# Altium schematic sheet [04] - Display.SchDoc: =ProjectName
size A4; CheckedBy: Ven; Author: Ven; CompanyName: HUST; Revision: V.1.0
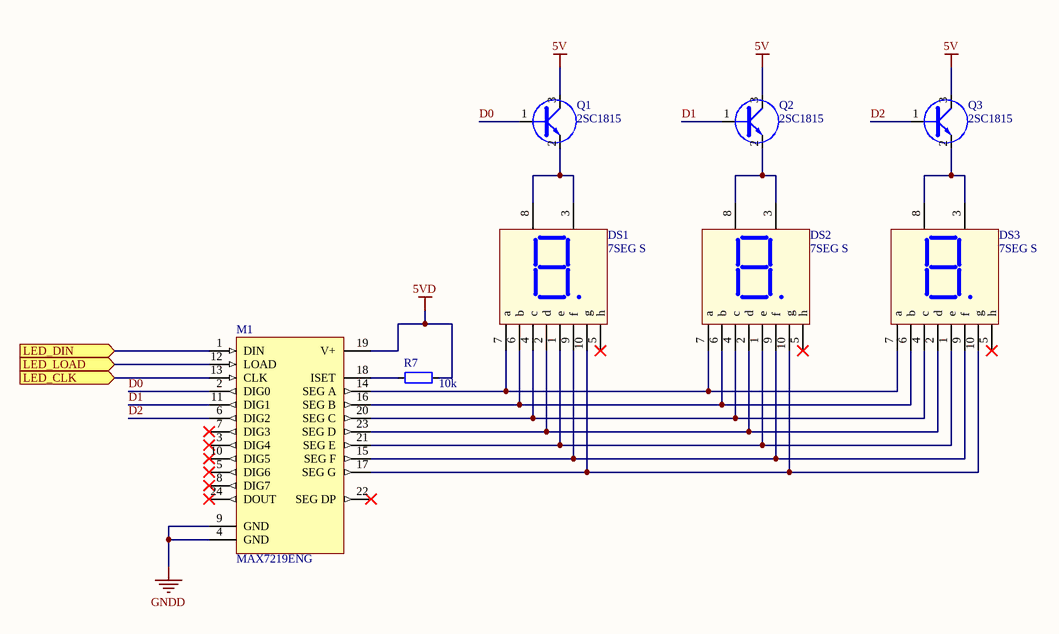
[diagram p0: [04] - Display.SchDoc]

## Parts
DS1  7SEG S  [7SEGS]
DS2  7SEG S  [7SEGS]
DS3  7SEG S  [7SEGS]
M1  MAX7219ENG  [DIP24/W0.3]
Q1  2SC1815  [SOT23D]
Q2  2SC1815  [SOT23D]
Q3  2SC1815  [SOT23D]
R7  10k  [RES-SMD-0805]

## Ports
LED_CLK (in), LED_DIN (in), LED_LOAD (in)

## Nets
5V: Q1.3(C) Q2.3(C) Q3.3(C)
5VD: M1.19(V+) R7.1
GNDD: M1.4(GND) M1.9(GND)
D0: M1.2(DIG0) Q1.1(B)
D1: M1.11(DIG1) Q2.1(B)
D2: M1.6(DIG2) Q3.1(B)
LED_CLK: M1.13(CLK) ; port LED_CLK
LED_DIN: M1.1(DIN) ; port LED_DIN
LED_LOAD: M1.12(LOAD) ; port LED_LOAD
NetDS1_1: DS1.1(e) DS2.1(e) DS3.1(e) M1.21(SEG_E)
NetDS1_2: DS1.2(d) DS2.2(d) DS3.2(d) M1.23(SEG_D)
NetDS1_3: DS1.3(Vcc) DS1.8(Vcc) Q1.2(E)
NetDS1_4: DS1.4(c) DS2.4(c) DS3.4(c) M1.20(SEG_C)
NetDS1_6: DS1.6(b) DS2.6(b) DS3.6(b) M1.16(SEG_B)
NetDS1_7: DS1.7(a) DS2.7(a) DS3.7(a) M1.14(SEG_A)
NetDS1_9: DS1.9(f) DS2.9(f) DS3.9(f) M1.15(SEG_F)
NetDS1_10: DS1.10(g) DS2.10(g) DS3.10(g) M1.17(SEG_G)
NetDS2_3: DS2.3(Vcc) DS2.8(Vcc) Q2.2(E)
NetDS3_3: DS3.3(Vcc) DS3.8(Vcc) Q3.2(E)
NetM1_18: M1.18(ISET) R7.2

Not connected (* = marked no-connect by the designer): DS1 5(h)*; DS2 5(h)*; DS3 5(h)*; M1 3(DIG4)* 5(DIG6)* 7(DIG3)* 8(DIG7)* 10(DIG5)* 22(SEG_DP)* 24(DOUT)*

## Notes on the sheet
- Project:
- Page Contents:
- Size:
- Date:
- A4
- Checked by:
- Time:
- Revision:
- Sheet
- of
- File:

## Library data of the parts
DS1-DS3 = LED7S: Single 7 Seg Dipslay; Value: LED 7S SEG
M1 = MAX7219ENG: Serially Interfaced, 8-Digit LED Display Driver; Published: 16-Jan-2001; LatestRevisionDate: 29-May-2009; LatestRevisionNote: Component Body Added.; DatasheetVersion: Jul-1997; PackageVersion: 1997; PackageReference: NG24A; Publisher: Altium Limited; PackageDescription: DIP, 24-Pin, Row Spacing 7.62 mm, Pitch 2.54 mm; Code_JEDEC: MS-001-AF; ComponentLink1Description: Manufacturer Link; ComponentLink1URL: http://www.maxim-ic.com/; ComponentLink2Description: Datasheet; ComponentLink2URL: http://pdfserv.maxim-ic.com/en/ds/MAX7219-MAX7221.pdf
Q1-Q3 = 2SC1815: NPN 600mW, ECB; Value: C1815
R7 = Resistor - SMD: Resistor; Manufacturer: Generic Components; Class: Passive; Published: 08/06/2000; Publisher: Altium Hobart Technology Centre